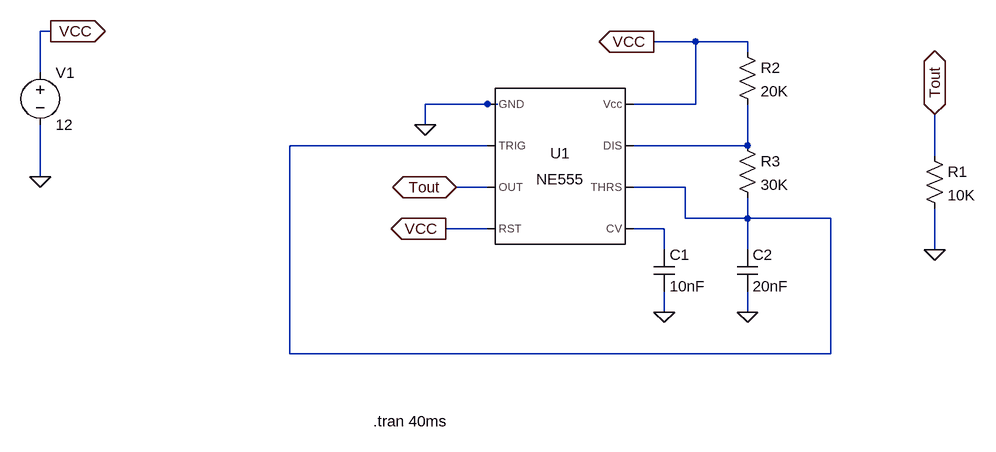
[diagram p0: schematic ne555_osillator.asc]
ne555_osillator.asc, the LTspice schematic file:
Version 4
SHEET 1 880 680
WIRE -576 -16 -592 -16
WIRE 416 0 352 0
WIRE 496 0 416 0
WIRE 496 16 496 0
WIRE -592 48 -592 -16
WIRE 96 96 0 96
WIRE 112 96 96 96
WIRE 416 96 416 0
WIRE 416 96 320 96
WIRE 0 128 0 96
WIRE 96 160 -208 160
WIRE 496 160 496 96
WIRE 496 160 320 160
WIRE 784 176 784 112
WIRE -592 208 -592 128
WIRE 96 224 48 224
WIRE 400 224 320 224
WIRE 400 272 400 224
WIRE 496 272 496 240
WIRE 496 272 400 272
WIRE 624 272 496 272
WIRE 96 288 32 288
WIRE 368 288 320 288
WIRE 368 320 368 288
WIRE 496 320 496 272
WIRE 784 320 784 256
WIRE 368 416 368 384
WIRE 496 416 496 384
WIRE -208 480 -208 160
WIRE 624 480 624 272
WIRE 624 480 -208 480
FLAG -576 -16 VCC
IOPIN -576 -16 Out
FLAG 352 0 VCC
IOPIN 352 0 Out
FLAG 32 288 VCC
IOPIN 32 288 Out
FLAG -592 208 0
FLAG 0 128 0
FLAG 368 416 0
FLAG 496 416 0
FLAG 784 320 0
FLAG 48 224 Tout
IOPIN 48 224 BiDir
FLAG 784 112 Tout
IOPIN 784 112 BiDir
SYMBOL Misc\\NE555 208 192 R0
SYMATTR InstName U1
SYMBOL voltage -592 32 R0
WINDOW 123 0 0 Left 0
WINDOW 39 0 0 Left 0
SYMATTR InstName V1
SYMATTR Value 12
SYMBOL cap 352 320 R0
SYMATTR InstName C1
SYMATTR Value 10nF
SYMBOL cap 480 320 R0
SYMATTR InstName C2
SYMATTR Value 20nF
SYMBOL res 768 160 R0
SYMATTR InstName R1
SYMATTR Value 10K
SYMBOL res 480 0 R0
SYMATTR InstName R2
SYMATTR Value 20K
SYMBOL res 480 144 R0
SYMATTR InstName R3
SYMATTR Value 30K
TEXT -80 584 Left 2 !.tran 40ms

The netlist it stands for:
* ne555_osillator.asc
XU1 0 N001 Tout VCC N003 N001 N002 VCC NE555  ; pins GND TRIG OUT RST CV THRS DIS Vcc
V1 VCC 0 12
C1 N003 0 10nF
C2 N001 0 20nF
R1 Tout 0 10K
R2 VCC N002 20K
R3 N002 N001 30K
.tran 40ms
.lib NE555.sub
.backanno
.end